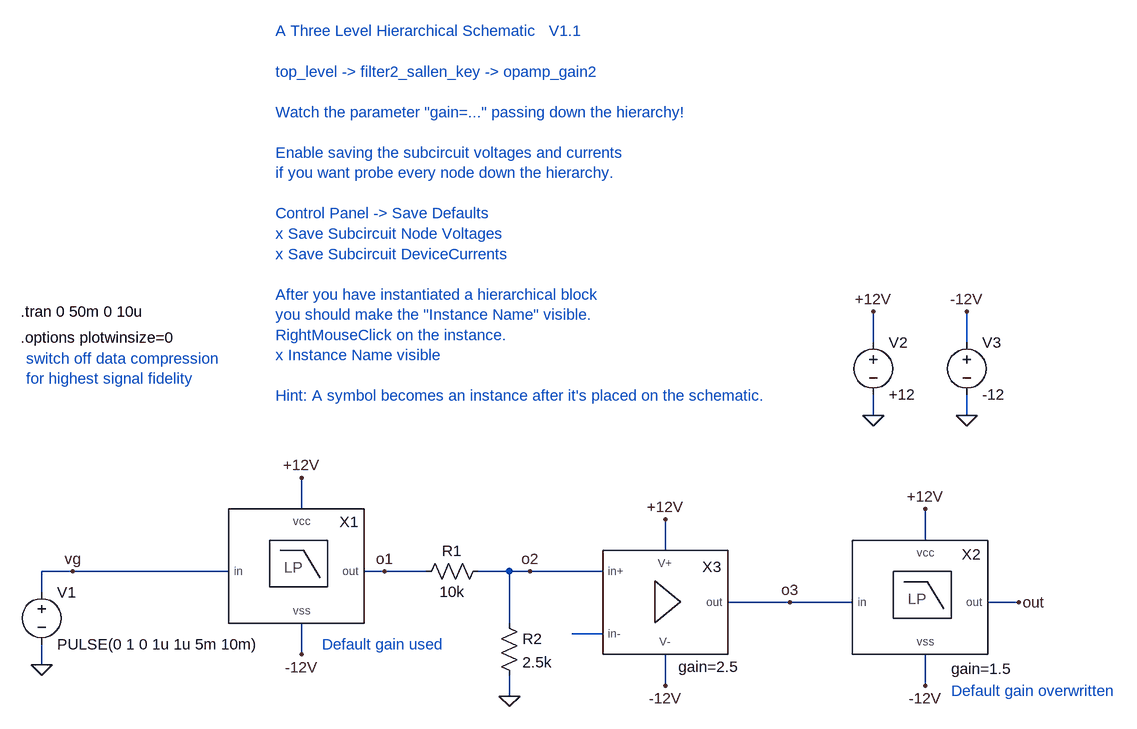
[diagram p0: schematic top_level.asc]
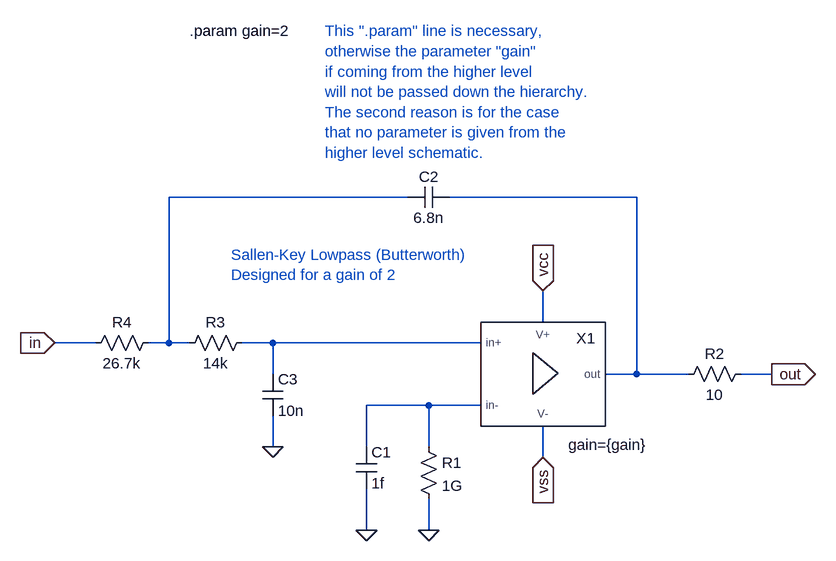
[diagram p1: sub-circuit filter2_sallen_key.asc]
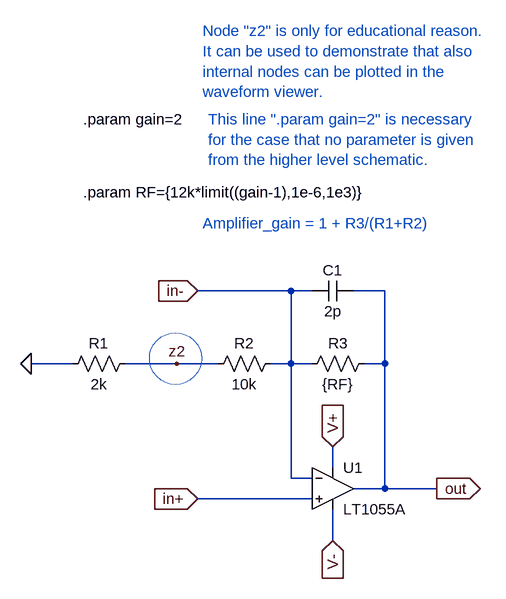
[diagram p2: sub-circuit opamp_gain2.asc]
top_level.asc, the LTspice schematic file:
Version 4
SHEET 1 1288 708
WIRE -400 288 -400 256
WIRE -400 400 -400 368
WIRE -352 256 -400 256
WIRE -112 256 -352 256
WIRE 0 160 0 112
WIRE 0 384 0 336
WIRE 128 256 96 256
WIRE 192 256 128 256
WIRE 320 256 272 256
WIRE 320 336 320 256
WIRE 320 448 320 416
WIRE 352 256 320 256
WIRE 464 256 352 256
WIRE 464 352 416 352
WIRE 560 224 560 176
WIRE 560 432 560 384
WIRE 752 304 656 304
WIRE 848 304 752 304
WIRE 880 -96 880 -144
WIRE 880 16 880 -16
WIRE 960 208 960 160
WIRE 960 432 960 384
WIRE 1024 -96 1024 -144
WIRE 1024 16 1024 -16
WIRE 1104 304 1056 304
FLAG 320 448 0
FLAG -400 400 0
FLAG -352 256 vg
FLAG 128 256 o1
FLAG 352 256 o2
FLAG 0 112 +12V
FLAG 0 384 -12V
FLAG 560 176 +12V
FLAG 960 160 +12V
FLAG 560 432 -12V
FLAG 960 432 -12V
FLAG 1024 16 0
FLAG 880 16 0
FLAG 880 -144 +12V
FLAG 1024 -144 -12V
FLAG 752 304 o3
FLAG 1104 304 out
SYMBOL filter2_sallen_key -48 224 R0
WINDOW 0 107 -44 Left 0
SYMATTR InstName X1
SYMBOL res 176 272 R270
WINDOW 0 32 56 VTop 0
WINDOW 3 0 56 VBottom 0
SYMATTR InstName R1
SYMATTR Value 10k
SYMBOL filter2_sallen_key 912 272 R0
WINDOW 0 104 -42 Left 0
WINDOW 39 88 134 Left 0
SYMATTR InstName X2
SYMATTR SpiceLine gain=1.5
SYMBOL opamp_gain2 560 320 R0
WINDOW 0 57 -71 Left 0
WINDOW 39 20 83 Left 0
SYMATTR InstName X3
SYMATTR SpiceLine gain=2.5
SYMBOL res 304 320 R0
SYMATTR InstName R2
SYMATTR Value 2.5k
SYMBOL voltage -400 272 R0
WINDOW 123 0 0 Left 0
WINDOW 39 0 0 Left 0
SYMATTR InstName V1
SYMATTR Value PULSE(0 1 0 1u 1u 5m 10m)
SYMBOL voltage 880 -112 R0
SYMATTR InstName V2
SYMATTR Value +12
SYMBOL voltage 1024 -112 R0
SYMATTR InstName V3
SYMATTR Value -12
TEXT -432 -144 Left 0 !.tran 0 50m 0 10u
TEXT -432 -104 Left 0 !.options plotwinsize=0
TEXT -40 -576 Left 0 ;A Three Level Hierarchical Schematic   V1.1\n \ntop_level -> filter2_sallen_key -> opamp_gain2\n \nWatch the parameter "gain=..." passing down the hierarchy!\n \nEnable saving the subcircuit voltages and currents\nif you want probe every node down the hierarchy.\n \nControl Panel -> Save Defaults    \nx Save Subcircuit Node Voltages\nx Save Subcircuit DeviceCurrents\n \nAfter you have instantiated a hierarchical block\nyou should make the "Instance Name" visible.\nRightMouseClick on the instance.\nx Instance Name visible\n \nHint: A symbol becomes an instance after it's placed on the schematic.
TEXT -424 -72 Left 0 ;switch off data compression\nfor highest signal fidelity
TEXT 32 368 Left 0 ;Default gain used
TEXT 1000 440 Left 0 ;Default gain overwritten

filter2_sallen_key.asc, the sub-circuit schematic file:
Version 4
SHEET 1 880 680
WIRE -544 160 -608 160
WIRE -432 160 -464 160
WIRE -432 160 -432 -64
WIRE -400 160 -432 160
WIRE -272 160 -320 160
WIRE -272 208 -272 160
WIRE -272 320 -272 272
WIRE -128 320 -128 256
WIRE -128 448 -128 384
WIRE -64 -64 -432 -64
WIRE -32 256 -128 256
WIRE -32 320 -32 256
WIRE -32 448 -32 400
WIRE 48 160 -272 160
WIRE 48 256 -32 256
WIRE 144 128 144 80
WIRE 144 336 144 288
WIRE 288 -64 0 -64
WIRE 288 208 240 208
WIRE 288 208 288 -64
WIRE 368 208 288 208
WIRE 496 208 448 208
FLAG -32 448 0
FLAG -128 448 0
FLAG 144 80 vcc
IOPIN 144 80 In
FLAG 144 336 vss
IOPIN 144 336 In
FLAG 496 208 out
IOPIN 496 208 Out
FLAG -608 160 in
IOPIN -608 160 In
FLAG -272 320 0
SYMBOL opamp_gain2 144 224 R0
WINDOW 0 51 -71 Left 0
WINDOW 39 39 93 Left 0
SYMATTR InstName X1
SYMATTR SpiceLine gain={gain}
SYMBOL res -48 304 R0
SYMATTR InstName R1
SYMATTR Value 1G
SYMBOL cap -144 320 R0
SYMATTR InstName C1
SYMATTR Value 1f
SYMBOL res 352 224 R270
WINDOW 0 32 56 VTop 0
WINDOW 3 0 56 VBottom 0
SYMATTR InstName R2
SYMATTR Value 10
SYMBOL cap -64 -48 R270
WINDOW 0 32 32 VTop 0
WINDOW 3 0 32 VBottom 0
SYMATTR InstName C2
SYMATTR Value 6.8n
SYMBOL res -416 176 R270
WINDOW 0 32 56 VTop 0
WINDOW 3 0 56 VBottom 0
SYMATTR InstName R3
SYMATTR Value 14k
SYMBOL res -560 176 R270
WINDOW 0 32 56 VTop 0
WINDOW 3 0 56 VBottom 0
SYMATTR InstName R4
SYMATTR Value 26.7k
SYMBOL cap -288 208 R0
SYMATTR InstName C3
SYMATTR Value 10n
TEXT -400 -320 Left 0 !.param gain=2
TEXT -192 -320 Left 0 ;This ".param" line is necessary, \notherwise the parameter "gain"\nif coming from the higher level\nwill not be passed down the hierarchy.\nThe second reason is for the case\nthat no parameter is given from the \nhigher level schematic.
TEXT -336 24 Left 0 ;Sallen-Key Lowpass (Butterworth)\nDesigned for a gain of 2

opamp_gain2.asc, the sub-circuit schematic file:
Version 4
SHEET 1 880 680
WIRE -208 48 -272 48
WIRE -48 48 -128 48
WIRE 16 48 -48 48
WIRE 128 -64 -16 -64
WIRE 128 48 96 48
WIRE 128 48 128 -64
WIRE 128 224 128 48
WIRE 160 -64 128 -64
WIRE 160 48 128 48
WIRE 160 224 128 224
WIRE 160 256 -16 256
WIRE 192 208 192 176
WIRE 192 320 192 272
WIRE 272 -64 224 -64
WIRE 272 48 240 48
WIRE 272 48 272 -64
WIRE 272 240 224 240
WIRE 272 240 272 48
WIRE 352 240 272 240
FLAG -272 48 0
FLAG 352 240 out
IOPIN 352 240 Out
FLAG -16 256 in+
IOPIN -16 256 In
FLAG 192 176 V+
IOPIN 192 176 In
FLAG 192 320 V-
IOPIN 192 320 In
FLAG -16 -64 in-
IOPIN -16 -64 In
FLAG -48 48 z2
SYMBOL Opamps\\LT1055A 192 176 R0
SYMATTR InstName U1
SYMBOL res 144 64 R270
WINDOW 0 32 56 VTop 0
WINDOW 3 0 56 VBottom 0
SYMATTR InstName R3
SYMATTR Value {RF}
SYMBOL res 0 64 R270
WINDOW 0 32 56 VTop 0
WINDOW 3 0 56 VBottom 0
SYMATTR InstName R2
SYMATTR Value 10k
SYMBOL cap 160 -48 R270
WINDOW 0 32 32 VTop 0
WINDOW 3 0 32 VBottom 0
SYMATTR InstName C1
SYMATTR Value 2p
SYMBOL res -224 64 R270
WINDOW 0 32 56 VTop 0
WINDOW 3 0 56 VBottom 0
SYMATTR InstName R1
SYMATTR Value 2k
TEXT -192 -216 Left 0 !.param RF={12k*limit((gain-1),1e-6,1e3)}
TEXT -192 -328 Left 0 !.param gain=2
TEXT -8 -168 Left 0 ;Amplifier_gain = 1 + R3/(R1+R2)
TEXT 0 -328 Left 0 ;This line ".param gain=2" is necessary \nfor the case that no parameter is given \nfrom the higher level schematic.
TEXT -8 -464 Left 0 ;Node "z2" is only for educational reason.\nIt can be used to demonstrate that also\ninternal nodes can be plotted in the \nwaveform viewer.
CIRCLE Normal -10 80 -90 0 2

The netlist it stands for:
* top_level.asc
XX1 vg +12V -12V o1 filter2_sallen_key
R1 o1 o2 10k
XX2 o3 +12V -12V out filter2_sallen_key params: gain=1.5
XX3 o2 N001 +12V -12V o3 opamp_gain2 params: gain=2.5
R2 o2 0 2.5k
V1 vg 0 PULSE(0 1 0 1u 1u 5m 10m)
V2 +12V 0 +12
V3 -12V 0 -12

* block symbol definitions
.subckt filter2_sallen_key in vcc vss out
XX1 N002 N003 vcc vss N004 opamp_gain2 params: gain={gain}
R1 N003 0 1G
C1 N003 0 1f
R2 N004 out 10
C2 N001 N004 6.8n
R3 N001 N002 14k
R4 in N001 26.7k
C3 N002 0 10n
.param gain=2
* This ".param" line is necessary,
* otherwise the parameter "gain"
* if coming from the higher level
* will not be passed down the hierarchy.
* The second reason is for the case
* that no parameter is given from the
* higher level schematic.
* Sallen-Key Lowpass (Butterworth)
* Designed for a gain of 2
.ends filter2_sallen_key

.subckt opamp_gain2 in+ in- V+ V- out
XU1 in+ in- V+ V- out LT1055A  ; pins In+ In- V+ V- OUT
R3 in- out {RF}
R2 z2 in- 10k
C1 in- out 2p
R1 0 z2 2k
.param RF={12k*limit((gain-1),1e-6,1e3)}
.param gain=2
* Amplifier_gain = 1 + R3/(R1+R2)
* This line ".param gain=2" is necessary
* for the case that no parameter is given
* from the higher level schematic.
* Node "z2" is only for educational reason.
* It can be used to demonstrate that also
* internal nodes can be plotted in the
* waveform viewer.
.ends opamp_gain2

.tran 0 50m 0 10u
.options plotwinsize=0
* A Three Level Hierarchical Schematic   V1.1
* top_level -> filter2_sallen_key -> opamp_gain2
* Watch the parameter "gain=..." passing down the hierarchy!
* Enable saving the subcircuit voltages and currents
* if you want probe every node down the hierarchy.
* Control Panel -> Save Defaults
* x Save Subcircuit Node Voltages
* x Save Subcircuit DeviceCurrents
* After you have instantiated a hierarchical block
* you should make the "Instance Name" visible.
* RightMouseClick on the instance.
* x Instance Name visible
* Hint: A symbol becomes an instance after it's placed on the schematic.
* switch off data compression
* for highest signal fidelity
* Default gain used
* Default gain overwritten
.backanno
.end